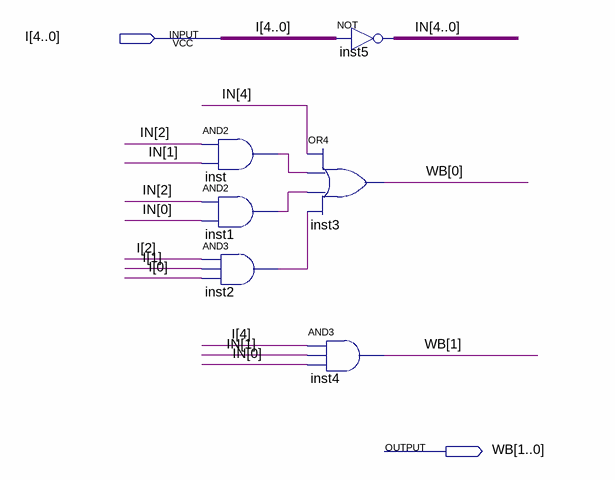
[diagram p0: schematic sheet]
// Quartus schematic WB.bdf as structural Verilog: 6 symbols, 2 pins
module WB (
  input  [4:0] I,
  output [1:0] WB
);

  wire inst1_out, inst2_out, inst_out;
  wire [4:0] IN;

  and inst (inst_out, IN[2], IN[1]);
  and inst1 (inst1_out, IN[2], IN[0]);
  and inst2 (inst2_out, I[2], I[1], I[0]);
  assign IN = ~I;  // NOT inst5, 5 bits wide
  or inst3 (WB[0], IN[4], inst_out, inst1_out, inst2_out);
  and inst4 (WB[1], I[4], IN[1], IN[0]);
endmodule
